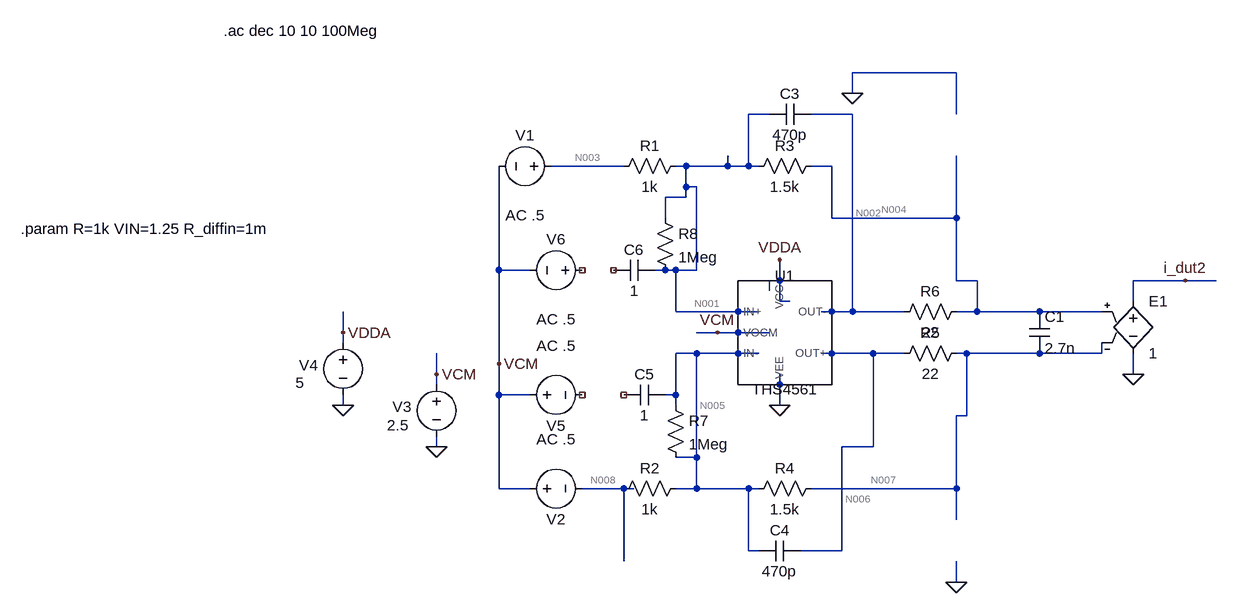
[diagram p0: schematic diff_ac.asc]
diff_ac.asc, the LTspice schematic file:
Version 4.1
SHEET 1 1288 680
WIRE 880 -176 720 -176
WIRE 720 -144 720 -176
WIRE 592 -112 560 -112
WIRE 720 -112 656 -112
WIRE 880 -112 880 -176
WIRE 368 -32 256 -32
WIRE 464 -32 448 -32
WIRE 528 -32 528 -48
WIRE 528 -32 464 -32
WIRE 560 -32 560 -112
WIRE 560 -32 528 -32
WIRE 576 -32 560 -32
WIRE 688 -32 656 -32
WIRE 464 0 464 -32
WIRE 480 0 464 0
WIRE 464 16 464 0
WIRE 464 16 432 16
WIRE 432 48 432 16
WIRE 688 48 688 -32
WIRE 880 48 880 -48
WIRE 880 48 688 48
WIRE 176 128 176 -32
WIRE 224 128 176 128
WIRE 432 128 416 128
WIRE 448 128 432 128
WIRE 480 128 480 0
WIRE 480 128 448 128
WIRE 608 144 608 112
WIRE 608 144 592 144
WIRE 880 144 880 48
WIRE 912 144 880 144
WIRE 1232 144 1152 144
WIRE 1280 144 1232 144
WIRE 592 160 592 144
WIRE 608 176 608 144
WIRE 624 176 608 176
WIRE 1152 176 1152 144
WIRE 448 192 448 128
WIRE 544 192 448 192
WIRE 576 192 544 192
WIRE 688 192 672 192
WIRE 720 192 720 -112
WIRE 720 192 688 192
WIRE 800 192 720 192
WIRE 912 192 912 144
WIRE 912 192 880 192
WIRE 1008 192 912 192
WIRE 1104 192 1008 192
WIRE -64 224 -64 192
WIRE 512 224 480 224
WIRE 544 224 512 224
WIRE 592 224 544 224
WIRE -64 240 -64 224
WIRE 480 256 448 256
WIRE 544 256 480 256
WIRE 576 256 544 256
WIRE 688 256 672 256
WIRE 752 256 688 256
WIRE 800 256 752 256
WIRE 896 256 880 256
WIRE 1008 256 896 256
WIRE 1104 256 1104 240
WIRE 1104 256 1008 256
WIRE 176 272 176 128
WIRE 80 288 80 256
WIRE 1152 288 1152 256
WIRE 80 304 80 288
WIRE 608 304 608 288
WIRE 608 304 592 304
WIRE 176 320 176 272
WIRE 224 320 176 320
WIRE 448 320 448 256
WIRE 448 320 432 320
WIRE -64 336 -64 320
WIRE 448 336 448 320
WIRE 608 336 608 304
WIRE 896 352 896 256
WIRE 896 352 880 352
WIRE 80 400 80 384
WIRE 752 400 752 256
WIRE 752 400 704 400
WIRE 480 416 480 256
WIRE 480 416 448 416
WIRE 176 464 176 320
WIRE 224 464 176 464
WIRE 368 464 304 464
WIRE 384 464 368 464
WIRE 480 464 480 416
WIRE 480 464 448 464
WIRE 560 464 480 464
WIRE 576 464 560 464
WIRE 880 464 880 352
WIRE 880 464 656 464
WIRE 880 512 880 464
WIRE 560 560 560 464
WIRE 576 560 560 560
WIRE 704 560 704 400
WIRE 704 560 640 560
WIRE 368 576 368 464
WIRE 880 608 880 576
FLAG 608 112 VDDA
FLAG 608 336 0
FLAG 1152 288 0
FLAG 1232 144 i_dut2
FLAG 720 -144 0
FLAG 880 608 0
FLAG 80 400 0
FLAG 80 288 VCM
FLAG -64 336 0
FLAG -64 224 VDDA
FLAG 176 272 VCM
FLAG 512 224 VCM
SYMBOL res 464 -48 R90
WINDOW 0 0 56 VBottom 2
WINDOW 3 32 56 VTop 2
SYMATTR InstName R1
SYMATTR Value 1k
SYMBOL res 464 448 R90
WINDOW 0 0 56 VBottom 2
WINDOW 3 32 56 VTop 2
SYMATTR InstName R2
SYMATTR Value 1k
SYMBOL res 672 -48 R90
WINDOW 0 0 56 VBottom 2
WINDOW 3 32 56 VTop 2
SYMATTR InstName R3
SYMATTR Value 1.5k
SYMBOL res 672 448 R90
WINDOW 0 0 56 VBottom 2
WINDOW 3 32 56 VTop 2
SYMATTR InstName R4
SYMATTR Value 1.5k
SYMBOL e 1152 160 R0
SYMATTR InstName E1
SYMATTR Value 1
SYMBOL res 896 240 R90
WINDOW 0 0 56 VBottom 2
WINDOW 3 32 56 VTop 2
SYMATTR InstName R5
SYMATTR Value 22
SYMBOL res 896 176 R90
WINDOW 0 0 56 VBottom 2
WINDOW 3 32 56 VTop 2
SYMATTR InstName R6
SYMATTR Value 22
SYMBOL cap 656 -128 R90
WINDOW 0 0 32 VBottom 2
WINDOW 3 32 32 VTop 2
SYMATTR InstName C3
SYMATTR Value 470p
SYMBOL cap 640 544 R90
WINDOW 0 0 32 VBottom 2
WINDOW 3 32 32 VTop 2
SYMATTR InstName C4
SYMATTR Value 470p
SYMBOL voltage 80 288 R0
WINDOW 0 -68 50 Left 2
WINDOW 3 -76 79 Left 2
WINDOW 123 -166 145 Left 2
WINDOW 39 0 0 Left 0
SYMATTR InstName V3
SYMATTR Value 2.5
SYMBOL voltage -64 224 R0
WINDOW 0 -68 50 Left 2
WINDOW 3 -73 77 Left 2
WINDOW 123 -166 145 Left 2
WINDOW 39 0 0 Left 0
SYMATTR InstName V4
SYMATTR Value 5
SYMBOL voltage 272 -32 R90
WINDOW 0 -32 56 VBottom 2
WINDOW 3 32 56 VTop 2
WINDOW 123 60 56 VTop 2
WINDOW 39 0 0 Left 0
SYMATTR InstName V1
SYMATTR Value ""
SYMATTR Value2 AC .5
SYMBOL voltage 208 464 R270
WINDOW 0 -32 56 VBottom 2
WINDOW 3 32 56 VTop 2
WINDOW 123 60 56 VTop 2
WINDOW 39 0 0 Left 0
SYMATTR InstName V2
SYMATTR Value ""
SYMATTR Value2 AC .5
SYMBOL models\\THS4561 608 224 R0
SYMATTR InstName U1
SYMBOL res 432 320 R0
SYMATTR InstName R7
SYMATTR Value 1Meg
SYMBOL res 416 32 R0
SYMATTR InstName R8
SYMATTR Value 1Meg
SYMBOL voltage 208 320 R270
WINDOW 0 -32 56 VBottom 2
WINDOW 3 32 56 VTop 2
WINDOW 123 60 56 VTop 2
WINDOW 39 0 0 Left 0
SYMATTR InstName V5
SYMATTR Value ""
SYMATTR Value2 AC .5
SYMBOL voltage 320 128 R90
WINDOW 0 -32 56 VBottom 2
WINDOW 3 32 56 VTop 2
WINDOW 123 60 56 VTop 2
WINDOW 39 0 0 Left 0
SYMATTR InstName V6
SYMATTR Value ""
SYMATTR Value2 AC .5
SYMBOL cap 432 304 R90
WINDOW 0 0 32 VBottom 2
WINDOW 3 32 32 VTop 2
SYMATTR InstName C5
SYMATTR Value 1
SYMBOL cap 416 112 R90
WINDOW 0 0 32 VBottom 2
WINDOW 3 32 32 VTop 2
SYMATTR InstName C6
SYMATTR Value 1
SYMBOL cap 992 192 R0
SYMATTR InstName C1
SYMATTR Value 2.7n
TEXT -560 64 Left 2 !.param R=1k VIN=1.25 R_diffin=1m
TEXT -248 -240 Left 2 !.ac dec 10 10 100Meg

The netlist it stands for:
* diff_ac.asc
R1 N001 N003 1k
R2 N005 N008 1k
R3 N004 N001 1.5k
R4 N007 N005 1.5k
E1 i_dut2 0 N004 N007 1
R5 N007 N006 22
R6 N004 N002 22
C3 N002 N001 470p
C4 N006 N005 470p
V3 VCM 0 2.5
V4 VDDA 0 5
V1 N003 VCM AC .5
V2 VCM N008 AC .5
X§U1 N001 N005 VDDA 0 N006 N002 VCM THS4561  ; pins IN+ IN- VCC VEE OUT+ OUT- VOCM
R7 N005 N005 1Meg
R8 N001 N001 1Meg
V5 VCM NC_01 AC .5
V6 NC_02 VCM AC .5
C5 N005 NC_03 1
C6 N001 NC_04 1
C1 N004 N007 2.7n
.param R=1k VIN=1.25 R_diffin=1m
.ac dec 10 10 100Meg
.lib C:\Users\owend\OneDrive\Desktop\LCR_Meter\repo\LCR_Meter\simulation\models\ths4561.txt
.backanno
.end

* Results of the author's LTspice run, read from the files saved beside the schematic
* Operating Point, zero values left out:
*   V(i_dut2) = -125.4 µV
*   V(n001) = 2.5 V
*   V(n002) = 2.5 V
*   V(n003) = 2.5 V
*   V(n004) = 2.5 V
*   V(n005) = 2.5 V
*   V(n006) = 2.5 V
*   V(n007) = 2.5 V
*   V(n008) = 2.5 V
*   V(vcm) = 2.5 V
*   V(vdda) = 5 V
*   I(R1) = 297.3 nA
*   I(R2) = 346.3 nA
*   I(R3) = -72.67 nA
*   I(R4) = -21.7 nA
*   I(R5) = 21.7 nA
*   I(R6) = 72.67 nA
*   I(V1) = 297.3 nA
*   I(V2) = -346.3 nA
*   I(V3) = 659.8 nA
*   I(V4) = -825 µA
*   Ix(u1:in+) = -370 nA
*   Ix(u1:in-) = -368 nA
*   Ix(u1:out+) = 21.7 nA
*   Ix(u1:out-) = 72.67 nA
*   Ix(u1:vcc) = 825 µA
*   Ix(u1:vee) = -825.1 µA
*   Ix(u1:vocm) = -16.15 nA
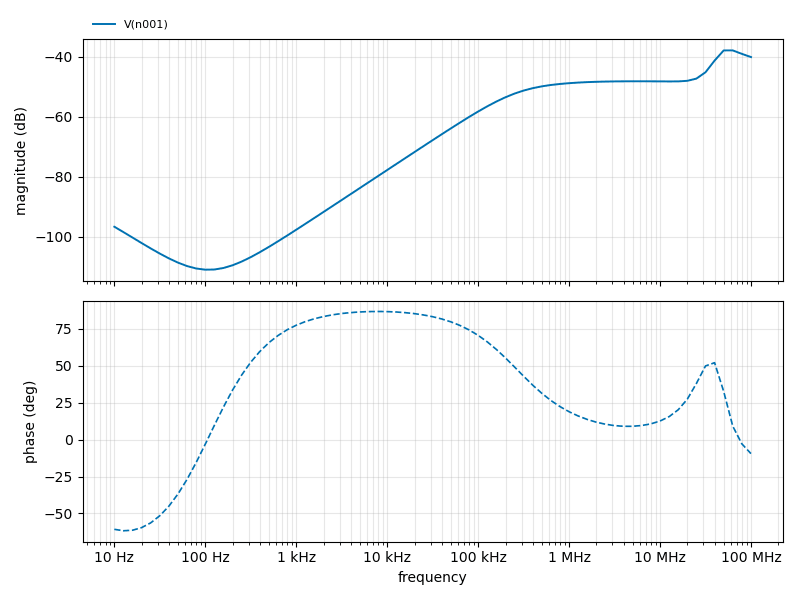
[diagram p1: AC Analysis of diff_ac.asc, plotted from the saved traces]
* AC Analysis, 1 run:
*   V(n001): -96.62 dB at 10 Hz, -40.09 dB at 100 MHz, peak -37.88 dB at 63.1 MHz, 3 dB below the peak at 40.85 MHz